# EAGLE design avr (EAGLE 6.5.0)
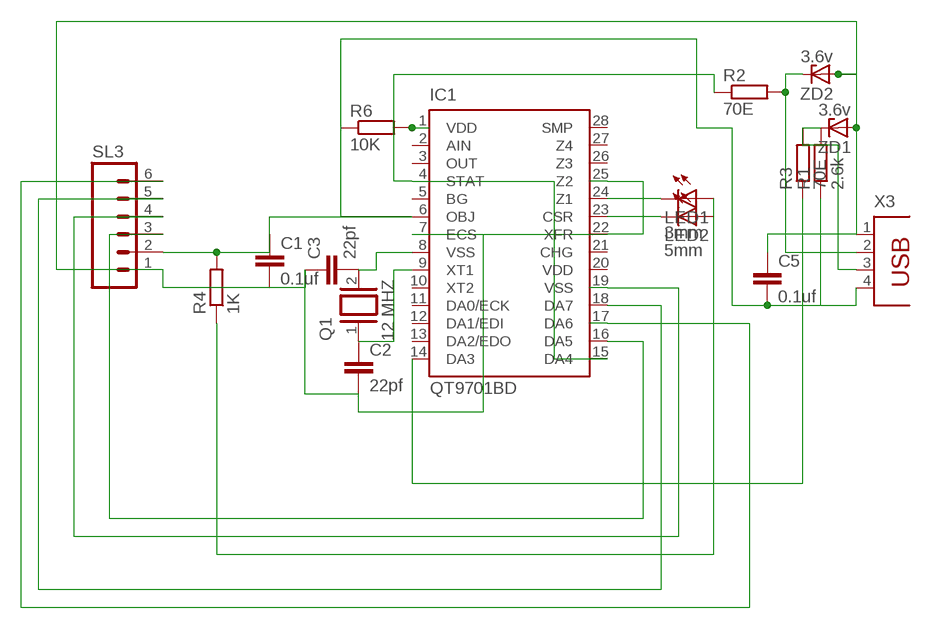
[diagram p0: schematic, sheet 1]

## Parts
C1  0.1uf  C2,5-3  [C2.5-3]
C2  22pf  C2,5-3  [C2.5-3]
C3  22pf  C2,5-3  [C2.5-3]
C5  0.1uf  C2,5-3  [C2.5-3]
IC1  QT9701BD  [DIL28-3]
LED1  3mm  LED3MM  [LED3MM]
LED2  5mm  LED3MM  [LED3MM]
Q1  12 MHZ  XTAL/S  [QS]
R1  2.6k  R-EU_0204/7  [0204/7]
R2  70E  R-EU_0204/7  [0204/7]
R3  70E  R-EU_0204/7  [0204/7]
R4  1K  R-EU_0204/7  [0204/7]
R6  10K  R-EU_0204/7  [0204/7]
SL3  M06  [06P]
X3  PN87520  [PN87520]
ZD1  3.6v  BZD23  [SOD81]
ZD2  3.6v  BZD23  [SOD81]

## Nets
N$1: C3.2 IC1.8(VSS) Q1.2
N$2: C2.1 IC1.9(XT1) Q1.1
N$3: C1.2 C2.2 C3.1 C5.1 IC1.7(ECS) IC1.22(XFR) IC1.25(Z2) SL3.1 X3.1 ZD1.A ZD2.A
N$4: IC1.24(Z1) LED1.K(C)
N$5: IC1.23(CSR) LED2.K(C)
N$6: R2.2 X3.2 ZD2.C
N$7: C1.1 C5.2 IC1.6(OBJ) R1.1 R4.2 R6.1 SL3.2 X3.4
N$8: IC1.4(STAT) IC1.15(DA4) R2.1
N$9: R1.2 R3.2 X3.3 ZD1.C
N$10: LED1.A LED2.A R4.1
N$11: IC1.14(DA3) R3.1
N$12: IC1.1(VDD) R6.2
N$13: IC1.17(DA6) SL3.6
N$14: IC1.16(DA5) SL3.3
N$15: IC1.18(DA7) SL3.5
N$24: IC1.19(VSS) SL3.4
Unconnected: IC1.2(AIN) IC1.3(OUT) IC1.5(BG) IC1.10(XT2) IC1.11(DA0/ECK) IC1.12(DA1/EDI) IC1.13(DA2/EDO) IC1.20(VDD) IC1.21(CHG) IC1.26(Z3) IC1.27(Z4) IC1.28(SMP)

## Library data of the parts
C1-C3 C5 = capacitor-wima:C: CAPACITOR naming: grid - package width
IC1 = quantum-research-group:QT9701B: Charge-Transfer Capacitance Sensor IC Source: http://data.qprox.com/downloads/datasheets/qt9701b.pdf; OC_FARNELL: unknown; OC_NEWARK: unknown
LED1 LED2 = led:LED: LED OSRAM: - CHIPLED LG R971, LG N971, LY N971, LG Q971, LY Q971, LO R971, LY R971 LH N974, LH R974 LS Q976, LO Q976, LY Q976 LO Q996 - Hyper CHIPLED LW Q18S LB Q993, LB Q99A, LB R99A - SideLED LS A670, LO A670, LY A670, LG A670, LP A670 LB A673, LV A673, LT A673, LW A673 LH A674 LY A675 LS A676, LA A676, LO A676, LY A676, LW A676 LS A679, LY A679, LG A679 - Hyper Micro SIDELED® LS Y876, LA Y876, LO Y876, LY Y876 LT Y87S - SmartLED LW L88C, LW L88S LB L89C, LB L89S, LG L890 LS L89K, LO L89K, LY L89K LS L896, LA L896, LO L896, LY L896 - TOPLED LS T670, LO T670, LY T670, LG T670, LP T670 LSG T670, LSP T670, LSY T670, LOP T670, LYG T670 LG T671, LOG T671, LSG T671 LB T673, LV T673, LT T673, LW T673 LH T674 LS T676, LA T676, LO T676, LY T676, LB T676, LH T676, LSB T676, LW T676 LB T67C, LV T67C, LT T67C, LS T67K, LO T67K, LY T67K, LW E67C LS E67B, LA E67B, LO E67B, LY E67B, LB E67C, LV E67C, LT E67C LW T67C LS T679, LY T679, LG T679 LS T770, LO T770, LY T770, LG T770, LP T770 LB T773, LV T773, LT T773, LW T773 LH T774 LS E675, LA E675, LY E675, LS T675 LS T776, LA T776, LO T776, LY T776, LB T776 LHGB T686 LT T68C, LB T68C - Hyper Mini TOPLED® LB M676 - Mini TOPLED Santana® LG M470 LS M47K, LO M47K, LY M47K Source: http://www.osram.convergy.de LUXEON: - LUMILED® LXK2-PW12-R00, LXK2-PW12-S00, LXK2-PW14-U00, LXK2-PW14-V00 LXK2-PM12-R00, LXK2-PM12-S00, LXK2-PM14-U00 LXK2-PE12-Q00, LXK2-PE12-R00, LXK2-PE12-S00, LXK2-PE14-T00, LXK2-PE14-U00 LXK2-PB12-K00, LXK2-PB12-L00, LXK2-PB12-M00, LXK2-PB14-N00, LXK2-PB14-P00, LXK2-PB14-Q00 LXK2-PR12-L00, LXK2-PR12-M00, LXK2-PR14-Q00, LXK2-PR14-R00 LXK2-PD12-Q00, LXK2-PD12-R00, LXK2-PD12-S00 LXK2-PH12-R00, LXK2-PH12-S00 LXK2-PL12-P00, LXK2-PL12-Q00, LXK2-PL12-R00 Source: www.luxeon.com KINGBRIGHT: KA-3528ASYC Source: www.kingbright.com
Q1 = special:XTAL/S: CRYSTAL
R1-R4 R6 = resistor:R-EU_: RESISTOR, European symbol
SL3 = con-amp-quick:M06: AMP QUICK CONNECTOR; OC_FARNELL: unknown; OC_NEWARK: unknown
X3 = con-berg:PN87520: BERG USB connector; OC_FARNELL: unknown; OC_NEWARK: unknown
ZD1 ZD2 = diode:BZD23: Z DIODE

## Board
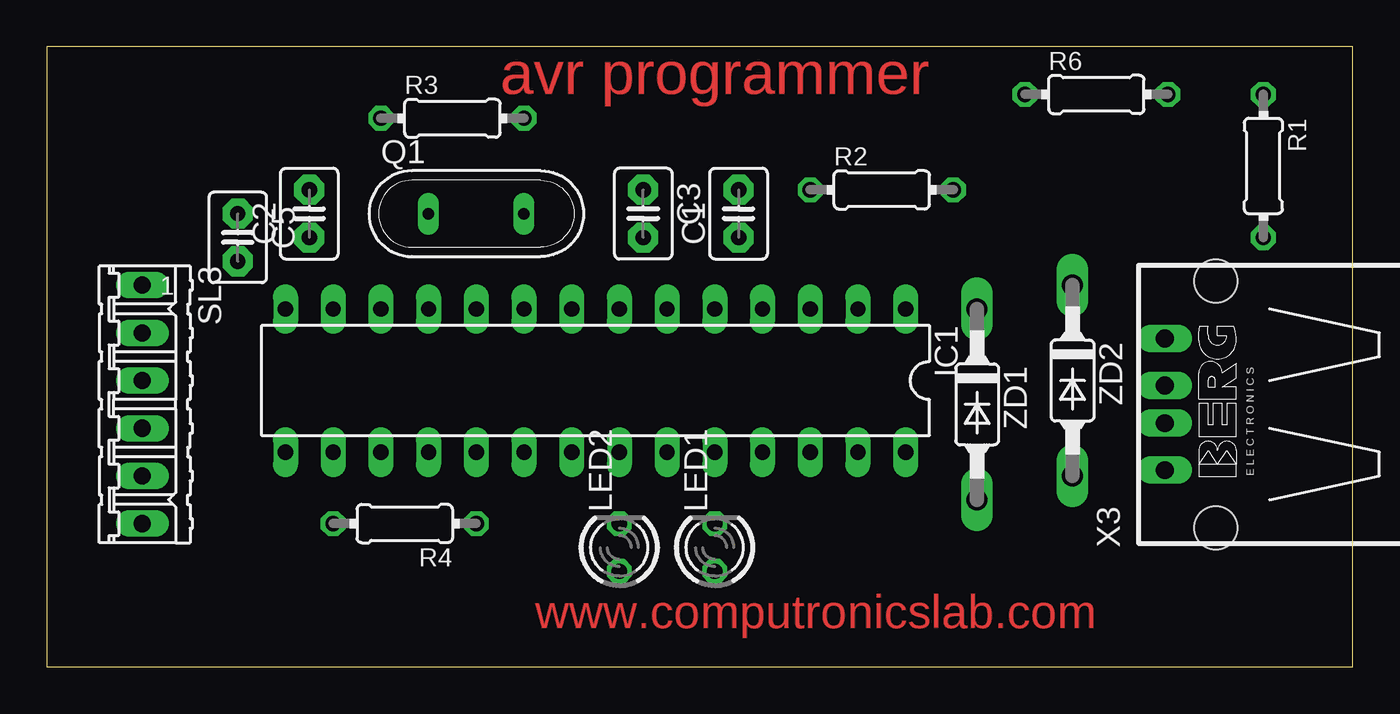
[diagram p1: board, top side]
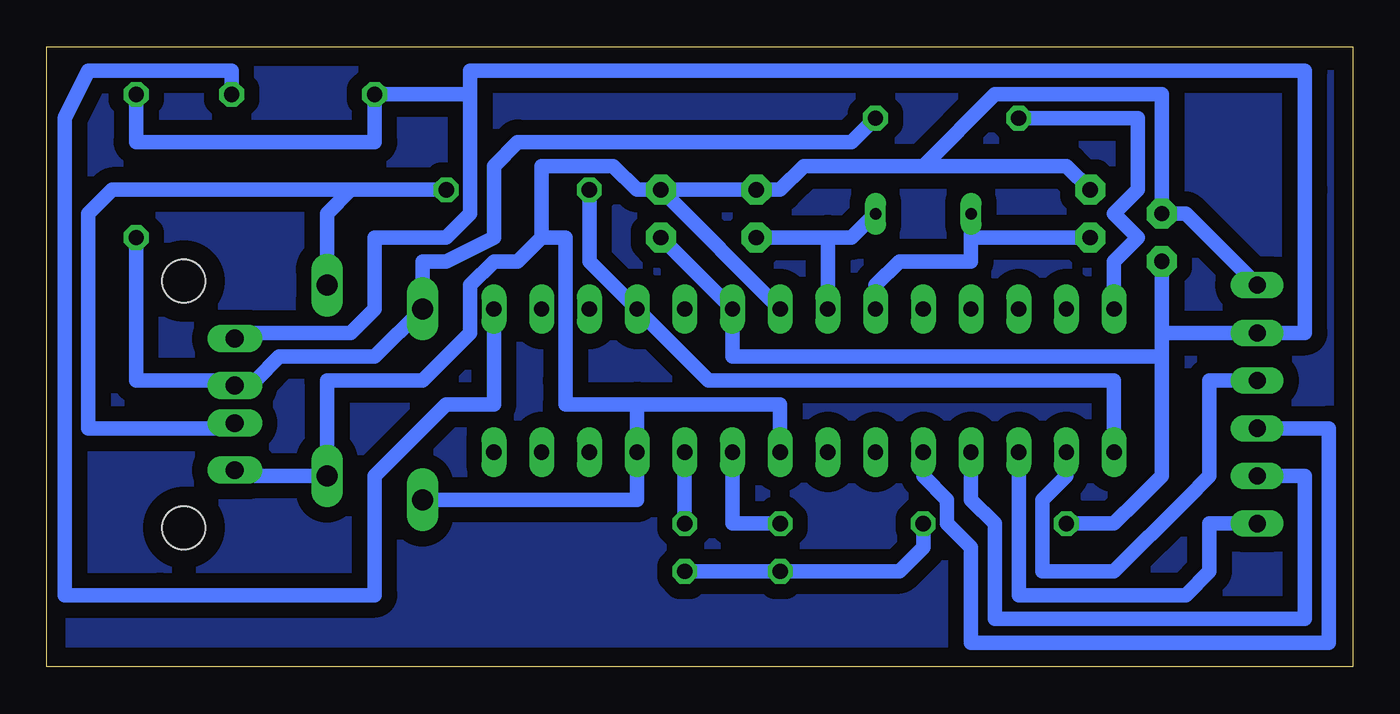
[diagram p2: board, bottom side, seen from below]

Size 69.52 x 33.01 mm. Coordinates in mm from the lower left corner, seen from the top.
Outline: 0,0 69.52,0 69.52,33.01 0,33.01 0,0
Copper layers (1*16): Top 0.035mm / dielectric 1.5mm / Bottom 0.035mm
Design rules: minimum track width 30mil, minimum drill 24mil, track to track 8mil, track to pad 8mil, pad to pad 8mil, via to via 8mil, smd to smd 8mil, copper to edge 40mil, drill to drill 8mil, minimum pad ring 10mil, minimum via ring 8mil, stop-mask expansion 4mil, vias tented up to drill 0mil, thermal gap 10mil

### Footprints (pad centres in the part's own frame; a part is rotated, then mirrored left to right if it is on the bottom)
C2.5-3 = drill 0.813 pad 1.6 octagon: 1 -1.27,0; 2 1.27,0
DIL28-3 = drill 0.813 long: 1 -16.51,-3.81; 2 -13.97,-3.81; 3 -11.43,-3.81; 4 -8.89,-3.81; 5 -6.35,-3.81; 6 -3.81,-3.81; 7 -1.27,-3.81; 8 1.27,-3.81; 9 3.81,-3.81; 10 6.35,-3.81; 11 8.89,-3.81; 12 11.43,-3.81; 13 13.97,-3.81; 14 16.51,-3.81; 15 16.51,3.81; 16 13.97,3.81; 17 11.43,3.81; 18 8.89,3.81; 19 6.35,3.81; 20 3.81,3.81; 21 1.27,3.81; 22 -1.27,3.81; 23 -3.81,3.81; 24 -6.35,3.81; 25 -8.89,3.81; 26 -11.43,3.81; 27 -13.97,3.81; 28 -16.51,3.81
LED3MM = drill 0.813 octagon: A -1.27,0; K 1.27,0
QS = drill 0.61 long: 1 -2.54,0; 2 2.54,0
0204/7 = drill 0.813 octagon: 1 -3.81,0; 2 3.81,0
06P = drill 0.914 long: 1 -6.35,0; 2 -3.81,0; 3 -1.27,0; 4 1.27,0; 5 3.81,0; 6 6.35,0
PN87520 = drill 0.95 long: 1 -3.5,2.71; 2 -1,2.71; 3 1,2.71; 4 3.5,2.71 | hole 2.3: -6.57,0; 6.57,0
SOD81 = drill 1.118 long: A 5.08,0; C -5.08,0

### Placement (x,y rotation side)
C1  36.83,24.13 90 top
C2  13.97,24.13 90 top
C3  31.75,24.13 270 top
C5  10.16,22.86 270 top
IC1  29.21,15.24 180 top
LED1  35.56,6.35 90 top
LED2  30.48,6.35 90 top
Q1  22.86,24.13 0 top
R1  64.77,26.67 270 top
R2  44.45,25.4 0 top
R3  21.59,29.21 0 top
R4  19.05,7.62 180 top
R6  55.88,30.48 0 top
SL3  5.08,13.97 270 top
X3  62.23,13.97 90 top
ZD1  49.53,13.97 270 top
ZD2  54.61,15.24 270 top

### Tracks (layer width: path | path; a pad name or v marks a point on that pad's centre or on a via)
N$1
  Bottom 0.762: Q1.2 26.67,22.86 27.94,22.86 | C3.2 27.94,22.86 | 27.94,22.86 IC1.8
N$2
  Bottom 0.762: C2.1 19.05,22.86 20.32,22.86 Q1.1 20.32,21.59 24.13,21.59 25.4,20.32 IC1.9
N$3
  Bottom 0.762: SL3.1 8.89,24.13 C5.1 10.16,30.48 19.05,30.48 22.86,26.67 | C2.2 15.24,26.67 22.86,26.67 | 22.86,26.67 29.21,26.67 30.48,25.4 C3.1 C1.2 | IC1.22 30.48,12.7 30.48,13.97 33.02,13.97 35.56,13.97 38.1,13.97 | 38.1,13.97 IC1.25 38.1,8.89 ZD1.A | X3.1 58.42,10.16 ZD2.A 54.61,15.24 49.53,15.24 46.99,17.78 46.99,20.32 45.72,21.59 44.45,21.59 43.18,22.86 | C1.2 IC1.7 | 43.18,22.86 43.18,26.67 39.37,26.67 38.1,25.4 C1.2 | 38.1,13.97 41.91,13.97 41.91,15.24 41.91,17.78 41.91,22.86 43.18,22.86
N$4
  Bottom 0.762: IC1.24 LED1.K
N$5
  Bottom 0.762: LED2.K 33.02,7.62 IC1.23
N$6
  Bottom 0.762: 53.34,25.4 R2.2 | 54.61,24.13 53.34,25.4 | ZD2.C 54.61,24.13 | 54.61,24.13 53.34,25.4 | 53.34,25.4 66.04,25.4 67.31,24.13 67.31,19.05 67.31,12.7 60.96,12.7 59.69,12.7 X3.2
N$7
  Bottom 0.762: R1.1 64.77,27.94 52.07,27.94 R6.1 46.99,30.48 | 46.99,30.48 46.99,24.13 48.26,22.86 49.53,22.86 52.07,22.86 52.07,19.05 53.34,17.78 58.42,17.78 X3.4 | C1.1 IC1.6 33.02,16.51 10.16,16.51 | R4.2 12.7,7.62 11.43,8.89 10.16,10.16 10.16,11.43 10.16,16.51 | C5.2 10.16,17.78 | 10.16,17.78 10.16,16.51 | 10.16,17.78 SL3.2 2.54,17.78 2.54,25.4 2.54,31.75 8.89,31.75 43.18,31.75 46.99,31.75 46.99,30.48
N$8
  Bottom 0.762: IC1.15 12.7,15.24 34.29,15.24 IC1.4 40.64,21.59 R2.1
N$9
  Bottom 0.762: R1.2 64.77,15.24 59.69,15.24 X3.3 58.42,15.24 57.15,16.51 52.07,16.51 ZD1.C 49.53,20.32 | R3.2 26.67,27.94 44.45,27.94 45.72,26.67 45.72,22.86 48.26,21.59 49.53,21.59 | 49.53,20.32 49.53,21.59 | 49.53,21.59 49.53,20.32 | 49.53,20.32 49.53,21.59
N$10
  Bottom 0.762: LED1.A LED2.A 24.13,5.08 22.86,6.35 R4.1
N$11
  Bottom 0.762: IC1.14 12.7,21.59 11.43,22.86 12.7,24.13 11.43,25.4 11.43,29.21 R3.1
N$12
  Bottom 0.762: IC1.1 45.72,13.97 48.26,13.97 52.07,10.16 52.07,3.81 63.5,3.81 68.58,3.81 68.58,8.89 68.58,29.21 67.31,31.75 59.69,31.75 R6.2
N$13
  Bottom 0.762: IC1.17 17.78,3.81 8.89,3.81 7.62,5.08 7.62,7.62 SL3.6
N$14
  Bottom 0.762: IC1.16 15.24,10.16 16.51,8.89 16.51,7.62 16.51,5.08 13.97,5.08 12.7,5.08 8.89,8.89 7.62,10.16 7.62,11.43 7.62,15.24 SL3.3
N$15
  Bottom 0.762: IC1.18 20.32,8.89 19.05,7.62 19.05,2.54 6.35,2.54 2.54,2.54 2.54,3.81 2.54,6.35 2.54,10.16 SL3.5
N$16
  pour Bottom (isolate 0.813): 3.81,0 1.27,0 0,1.27 0,30.48 2.54,33.02 67.31,33.02 69.85,30.48 69.85,2.54 67.31,0
N$24
  Bottom 0.762: IC1.19 22.86,10.16 21.59,8.89 21.59,7.62 20.32,6.35 20.32,1.27 5.08,1.27 1.27,1.27 1.27,5.08 1.27,12.7 SL3.4

### Text on the board
Top: avr programmer | www.computronicslab.com